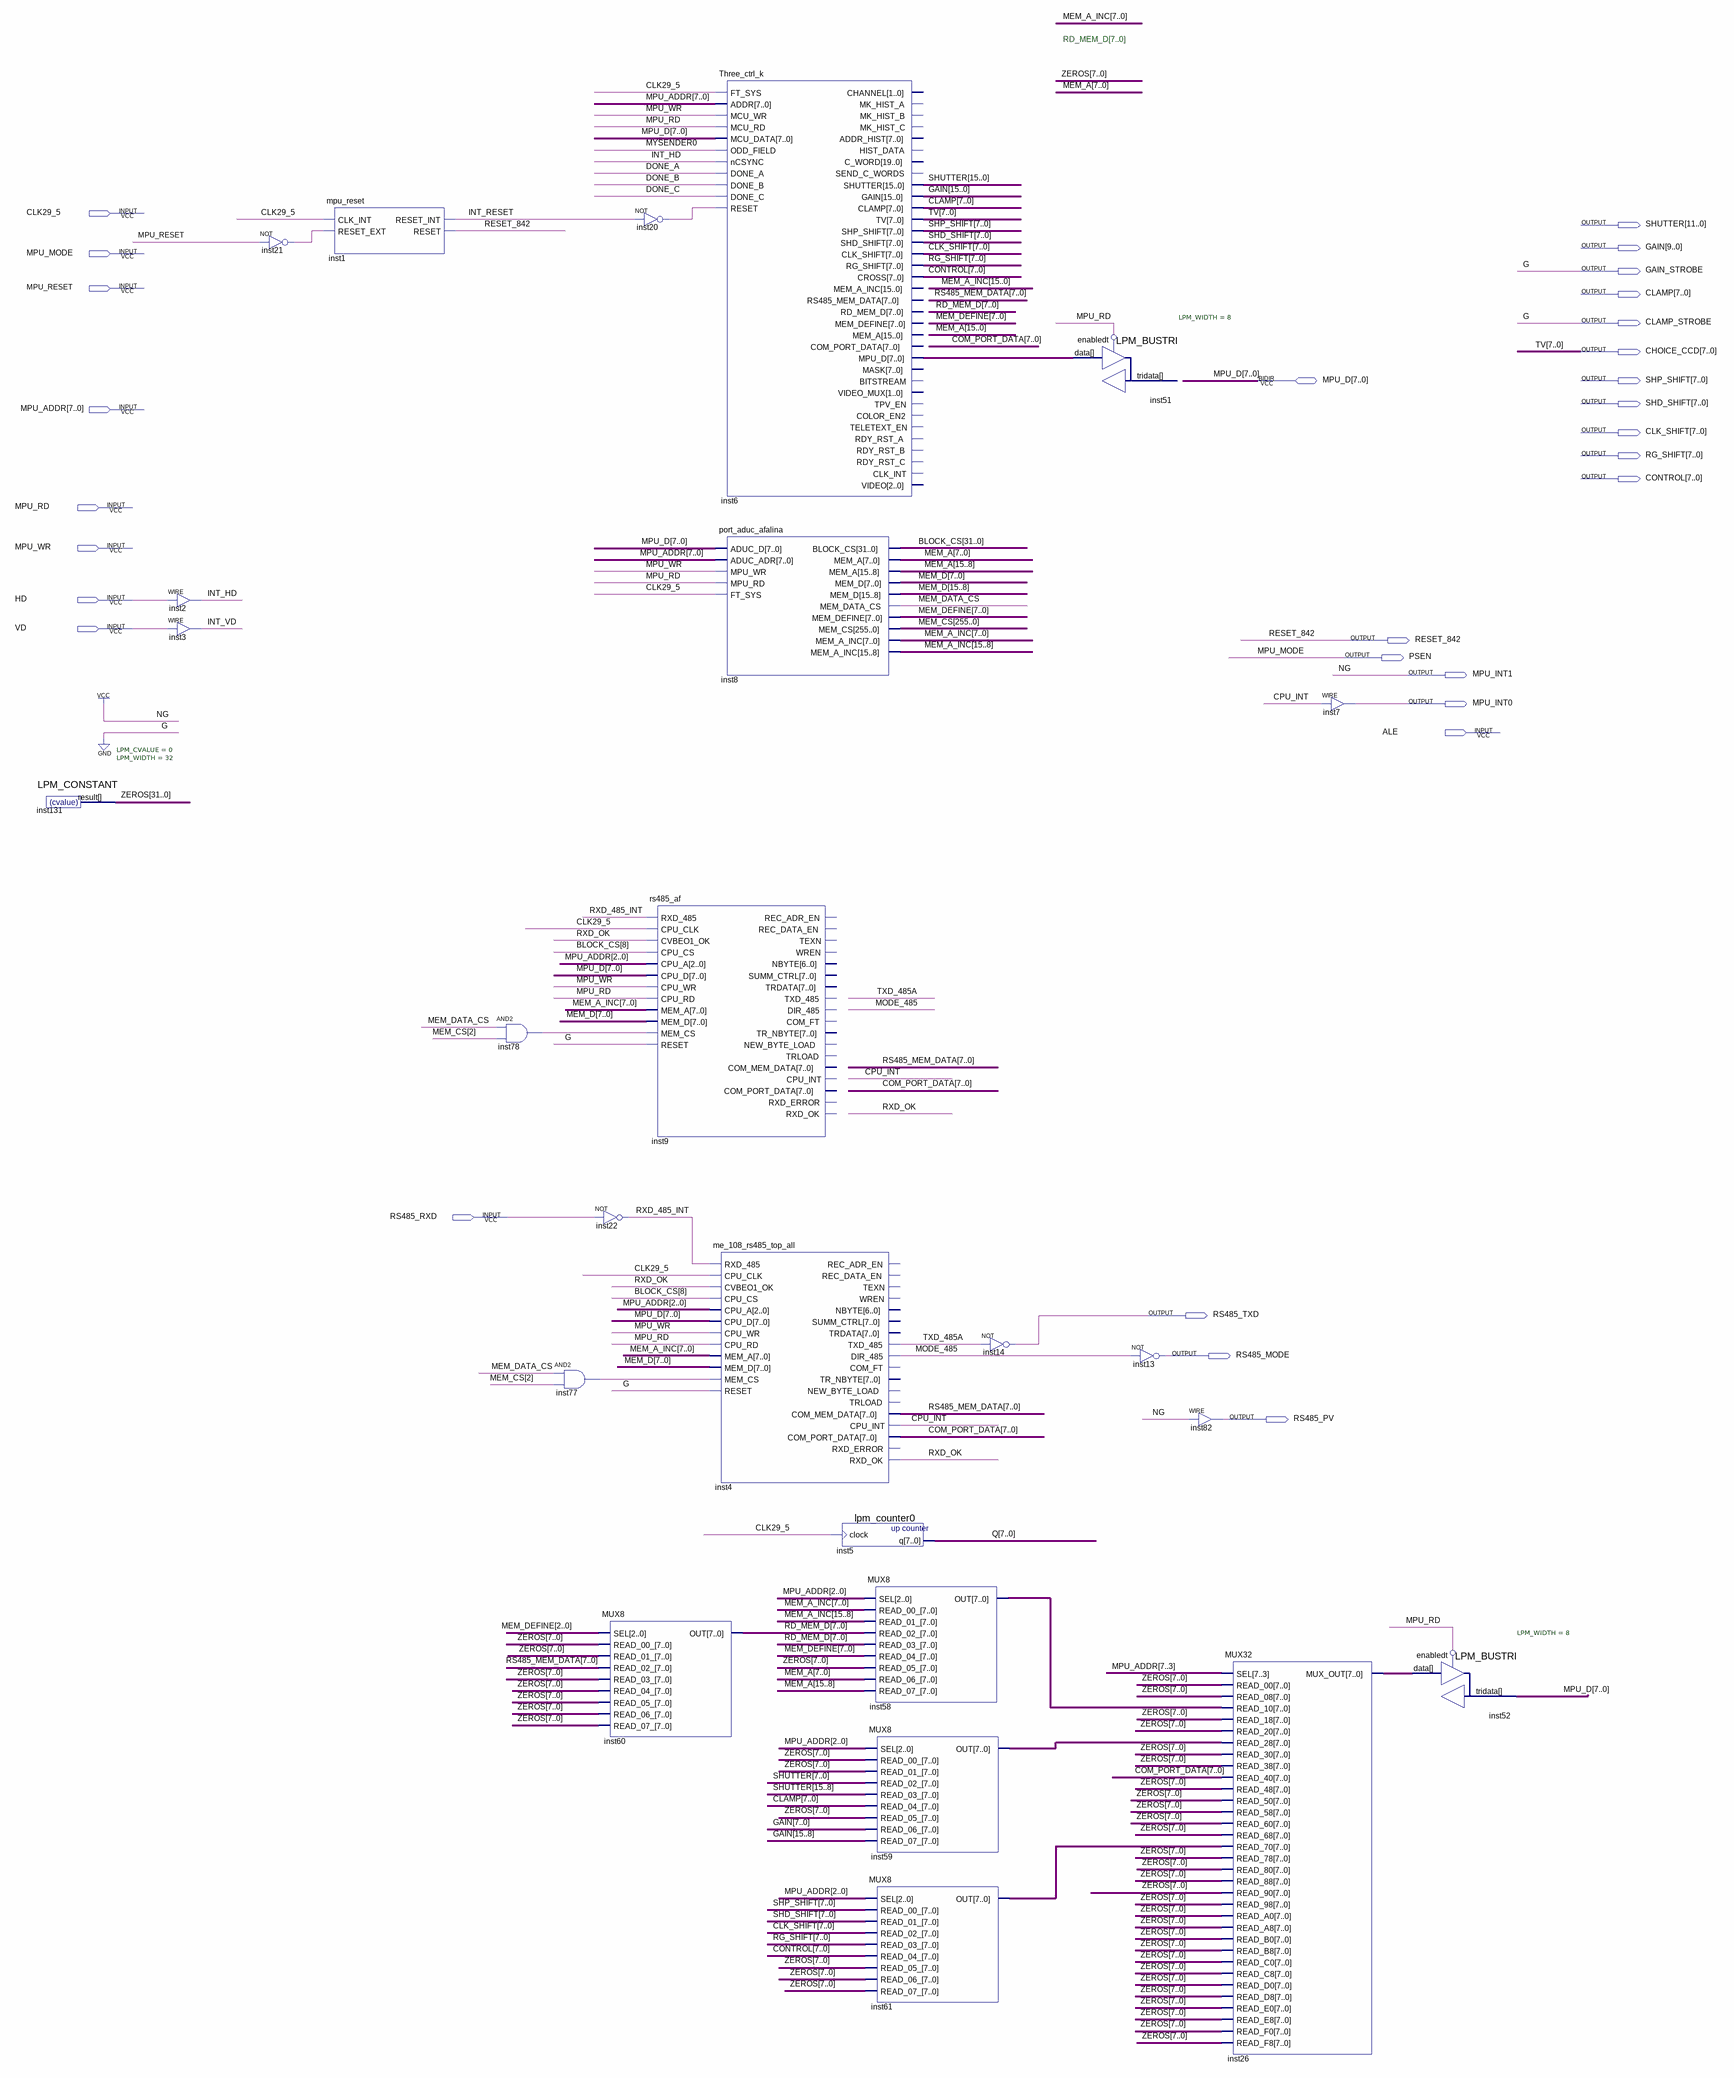
[diagram p0: schematic sheet]
// Quartus schematic aduc842.bdf as structural Verilog: 25 symbols, 29 pins
module aduc842 (
  input  CLK29_5,
  input  MPU_MODE,
  input  MPU_RESET,
  input  [7:0] MPU_ADDR,
  input  MPU_RD,
  input  MPU_WR,
  input  HD,
  input  VD,
  input  ALE,
  input  RS485_RXD,
  inout  [7:0] MPU_D,
  output [15:0] SHUTTER,
  output [15:0] GAIN,
  output GAIN_STROBE,
  output [7:0] CLAMP,
  output CLAMP_STROBE,
  output [7:0] CHOICE_CCD,
  output [7:0] SHP_SHIFT,
  output [7:0] SHD_SHIFT,
  output [7:0] CLK_SHIFT,
  output [7:0] RG_SHIFT,
  output [7:0] CONTROL,
  output RESET_842,
  output PSEN,
  output MPU_INT1,
  output MPU_INT0,
  output RS485_TXD,
  output RS485_MODE,
  output RS485_PV
);

  wire CPU_INT, DONE_A, DONE_B, DONE_C, inst20_out, inst21_out, inst77_out, inst78_out, INT_HD, INT_RESET,
       INT_VD, MEM_DATA_CS, MODE_485, MYSENDER0, RXD_485_INT, RXD_OK, TXD_485A;
  wire [7:0] COM_PORT_DATA, inst6_mpu_d, inst26_mux_out, inst58_out, inst59_out, inst61_out, MEM_DEFINE, Q,
       RD_MEM_D, RS485_MEM_DATA;
  wire [15:0] MEM_A, MEM_A_INC, MEM_D;
  wire [31:0] BLOCK_CS, ZEROS;
  wire [255:0] MEM_CS;

  LPM_CONSTANT #(.LPM_CVALUE(0), .LPM_WIDTH(32)) inst131 (.result(ZEROS));
  assign INT_HD = HD;  // WIRE inst2
  assign INT_VD = VD;  // WIRE inst3
  not inst21 (inst21_out, MPU_RESET);
  mpu_reset inst1 (.CLK_INT(CLK29_5), .RESET_EXT(inst21_out), .RESET_INT(INT_RESET), .RESET(RESET_842));
  and inst78 (inst78_out, MEM_DATA_CS, MEM_CS[2]);
  and inst77 (inst77_out, MEM_DATA_CS, MEM_CS[2]);
  not inst22 (RXD_485_INT, RS485_RXD);
  MUX8 inst60 (
    .SEL(MEM_DEFINE[2:0]), .READ_00_(ZEROS[7:0]), .READ_01_(ZEROS[7:0]), .READ_02_(RS485_MEM_DATA),
    .READ_03_(ZEROS[7:0]), .READ_04_(ZEROS[7:0]), .READ_05_(ZEROS[7:0]), .READ_06_(ZEROS[7:0]),
    .READ_07_(ZEROS[7:0]), .OUT(RD_MEM_D));
  not inst20 (inst20_out, INT_RESET);
  rs485_af inst9 (
    .RXD_485(RXD_485_INT), .CPU_CLK(CLK29_5), .CVBEO1_OK(RXD_OK), .CPU_CS(BLOCK_CS[8]),
    .CPU_A(MPU_ADDR[2:0]), .CPU_D(MPU_D), .CPU_WR(MPU_WR), .CPU_RD(MPU_RD), .MEM_A(MEM_A_INC[7:0]),
    .MEM_D(MEM_D[7:0]), .MEM_CS(inst78_out), .RESET(1'b0));  // open: REC_ADR_EN, REC_DATA_EN, TEXN, WREN, NBYTE, SUMM_CTRL, TRDATA, TXD_485, DIR_485, COM_FT, TR_NBYTE, NEW_BYTE_LOAD, TRLOAD, COM_MEM_DATA, CPU_INT, COM_PORT_DATA, RXD_ERROR, RXD_OK
  Three_ctrl_k inst6 (
    .FT_SYS(CLK29_5), .ADDR(MPU_ADDR), .MCU_WR(MPU_WR), .MCU_RD(MPU_RD), .MCU_DATA(MPU_D),
    .ODD_FIELD(MYSENDER0), .nCSYNC(INT_HD), .DONE_A(DONE_A), .DONE_B(DONE_B), .DONE_C(DONE_C),
    .RESET(inst20_out), .SHUTTER(SHUTTER), .GAIN(GAIN), .CLAMP(CLAMP), .TV(CHOICE_CCD),
    .SHP_SHIFT(SHP_SHIFT), .SHD_SHIFT(SHD_SHIFT), .CLK_SHIFT(CLK_SHIFT), .RG_SHIFT(RG_SHIFT),
    .CROSS(CONTROL), .MPU_D(inst6_mpu_d));  // open: CHANNEL, MK_HIST_A, MK_HIST_B, MK_HIST_C, ADDR_HIST, HIST_DATA, C_WORD, SEND_C_WORDS, MEM_A_INC, RS485_MEM_DATA, RD_MEM_D, MEM_DEFINE, MEM_A, COM_PORT_DATA, MASK, BITSTREAM, VIDEO_MUX, TPV_EN, COLOR_EN2, TELETEXT_EN, RDY_RST_A, RDY_RST_B, RDY_RST_C, CLK_INT, VIDEO
  port_aduc_afalina inst8 (
    .ADUC_D(MPU_D), .ADUC_ADR(MPU_ADDR), .MPU_WR(MPU_WR), .MPU_RD(MPU_RD), .FT_SYS(CLK29_5),
    .BLOCK_CS(BLOCK_CS), .MEM_A(MEM_A), .MEM_D(MEM_D), .MEM_DATA_CS(MEM_DATA_CS), .MEM_DEFINE(MEM_DEFINE),
    .MEM_CS(MEM_CS), .MEM_A_INC(MEM_A_INC));
  me_108_rs485_top_all inst4 (
    .RXD_485(RXD_485_INT), .CPU_CLK(CLK29_5), .CVBEO1_OK(RXD_OK), .CPU_CS(BLOCK_CS[8]),
    .CPU_A(MPU_ADDR[2:0]), .CPU_D(MPU_D), .CPU_WR(MPU_WR), .CPU_RD(MPU_RD), .MEM_A(MEM_A_INC[7:0]),
    .MEM_D(MEM_D[7:0]), .MEM_CS(inst77_out), .RESET(1'b0), .TXD_485(TXD_485A), .DIR_485(MODE_485),
    .COM_MEM_DATA(RS485_MEM_DATA), .CPU_INT(CPU_INT), .COM_PORT_DATA(COM_PORT_DATA), .RXD_OK(RXD_OK));  // open: REC_ADR_EN, REC_DATA_EN, TEXN, WREN, NBYTE, SUMM_CTRL, TRDATA, COM_FT, TR_NBYTE, NEW_BYTE_LOAD, TRLOAD, RXD_ERROR
  lpm_counter0 inst5 (.clock(CLK29_5), .q(Q));
  MUX8 inst58 (
    .SEL(MPU_ADDR[2:0]), .READ_00_(MEM_A_INC[7:0]), .READ_01_(MEM_A_INC[15:8]), .READ_02_(RD_MEM_D),
    .READ_03_(RD_MEM_D), .READ_04_(MEM_DEFINE), .READ_05_(ZEROS[7:0]), .READ_06_(MEM_A[7:0]),
    .READ_07_(MEM_A[15:8]), .OUT(inst58_out));
  MUX8 inst59 (
    .SEL(MPU_ADDR[2:0]), .READ_00_(ZEROS[7:0]), .READ_01_(ZEROS[7:0]), .READ_02_(SHUTTER[7:0]),
    .READ_03_(SHUTTER[15:8]), .READ_04_(CLAMP), .READ_05_(ZEROS[7:0]), .READ_06_(GAIN[7:0]),
    .READ_07_(GAIN[15:8]), .OUT(inst59_out));
  MUX8 inst61 (
    .SEL(MPU_ADDR[2:0]), .READ_00_(SHP_SHIFT), .READ_01_(SHD_SHIFT), .READ_02_(CLK_SHIFT),
    .READ_03_(RG_SHIFT), .READ_04_(CONTROL), .READ_05_(ZEROS[7:0]), .READ_06_(ZEROS[7:0]),
    .READ_07_(ZEROS[7:0]), .OUT(inst61_out));
  not inst14 (RS485_TXD, TXD_485A);
  LPM_BUSTRI #(.LPM_WIDTH(8)) inst51 (.data(inst6_mpu_d), .enabledt(~MPU_RD));  // open: tridata
  not inst13 (RS485_MODE, MODE_485);
  assign RS485_PV = 1'b1;  // WIRE inst82
  MUX32 inst26 (
    .SEL(MPU_ADDR[7:3]), .READ_00(ZEROS[7:0]), .READ_08(ZEROS[7:0]), .READ_10(inst58_out),
    .READ_18(ZEROS[7:0]), .READ_20(ZEROS[7:0]), .READ_28(inst59_out), .READ_30(ZEROS[7:0]),
    .READ_38(ZEROS[7:0]), .READ_40(COM_PORT_DATA), .READ_48(ZEROS[7:0]), .READ_50(ZEROS[7:0]),
    .READ_58(ZEROS[7:0]), .READ_60(ZEROS[7:0]), .READ_68(ZEROS[7:0]), .READ_70(inst61_out),
    .READ_78(ZEROS[7:0]), .READ_80(ZEROS[7:0]), .READ_88(ZEROS[7:0]), .READ_90(ZEROS[7:0]),
    .READ_98(ZEROS[7:0]), .READ_A0(ZEROS[7:0]), .READ_A8(ZEROS[7:0]), .READ_B0(ZEROS[7:0]),
    .READ_B8(ZEROS[7:0]), .READ_C0(ZEROS[7:0]), .READ_C8(ZEROS[7:0]), .READ_D0(ZEROS[7:0]),
    .READ_D8(ZEROS[7:0]), .READ_E0(ZEROS[7:0]), .READ_E8(ZEROS[7:0]), .READ_F0(ZEROS[7:0]),
    .READ_F8(ZEROS[7:0]), .MUX_OUT(inst26_mux_out));
  assign MPU_INT0 = CPU_INT;  // WIRE inst7
  LPM_BUSTRI #(.LPM_WIDTH(8)) inst52 (.data(inst26_mux_out), .enabledt(~MPU_RD), .tridata(MPU_D));

  assign CLAMP_STROBE = 1'b0;
  assign GAIN_STROBE = 1'b0;
  assign MPU_INT1 = 1'b1;
  assign PSEN = MPU_MODE;

  // Other names for the same wires on the sheet: TV[7:0] = CHOICE_CCD

  // Notes on the sheet:
  //   RD_MEM_D[7..0]
endmodule
